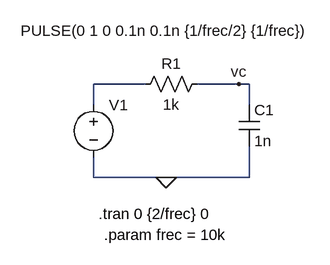
[diagram p0: schematic Draft21.asc]
Draft21.asc, the LTspice schematic file:
Version 4
SHEET 1 880 680
WIRE 96 80 16 80
WIRE 240 80 176 80
WIRE 256 80 240 80
WIRE 16 112 16 80
WIRE 256 112 256 80
WIRE 16 224 16 192
WIRE 128 224 16 224
WIRE 256 224 256 176
WIRE 256 224 128 224
FLAG 128 224 0
FLAG 240 80 vc
SYMBOL voltage 16 96 R0
WINDOW 3 -112 -98 Left 2
WINDOW 123 0 0 Left 0
WINDOW 39 0 0 Left 0
SYMATTR InstName V1
SYMATTR Value PULSE(0 1 0 0.1n 0.1n {1/frec/2} {1/frec})
SYMBOL res 192 64 R90
WINDOW 0 0 56 VBottom 2
WINDOW 3 32 56 VTop 2
SYMATTR InstName R1
SYMATTR Value 1k
SYMBOL cap 240 112 R0
SYMATTR InstName C1
SYMATTR Value 1n
TEXT 24 280 Left 2 !.tran 0 {2/frec} 0
TEXT 32 312 Left 2 !.param frec = 10k

The netlist it stands for:
* Draft21.asc
V1 N001 0 PULSE(0 1 0 0.1n 0.1n {1/frec/2} {1/frec})
R1 vc N001 1k
C1 vc 0 1n
.tran 0 {2/frec} 0
.param frec = 10k
.backanno
.end